# EasyEDA Pro project ProProject_f401_audio_adc_2024-01-29.epro

# Schematic Schematic1
Create Date: 2024-01-06; Page Name: P1; Project Name: f401_audio_adc; Schematic Name: Schematic1; Update Date: 2024-01-11; Company: 嘉立创EDA; Page Size: A4; Version: V1.0
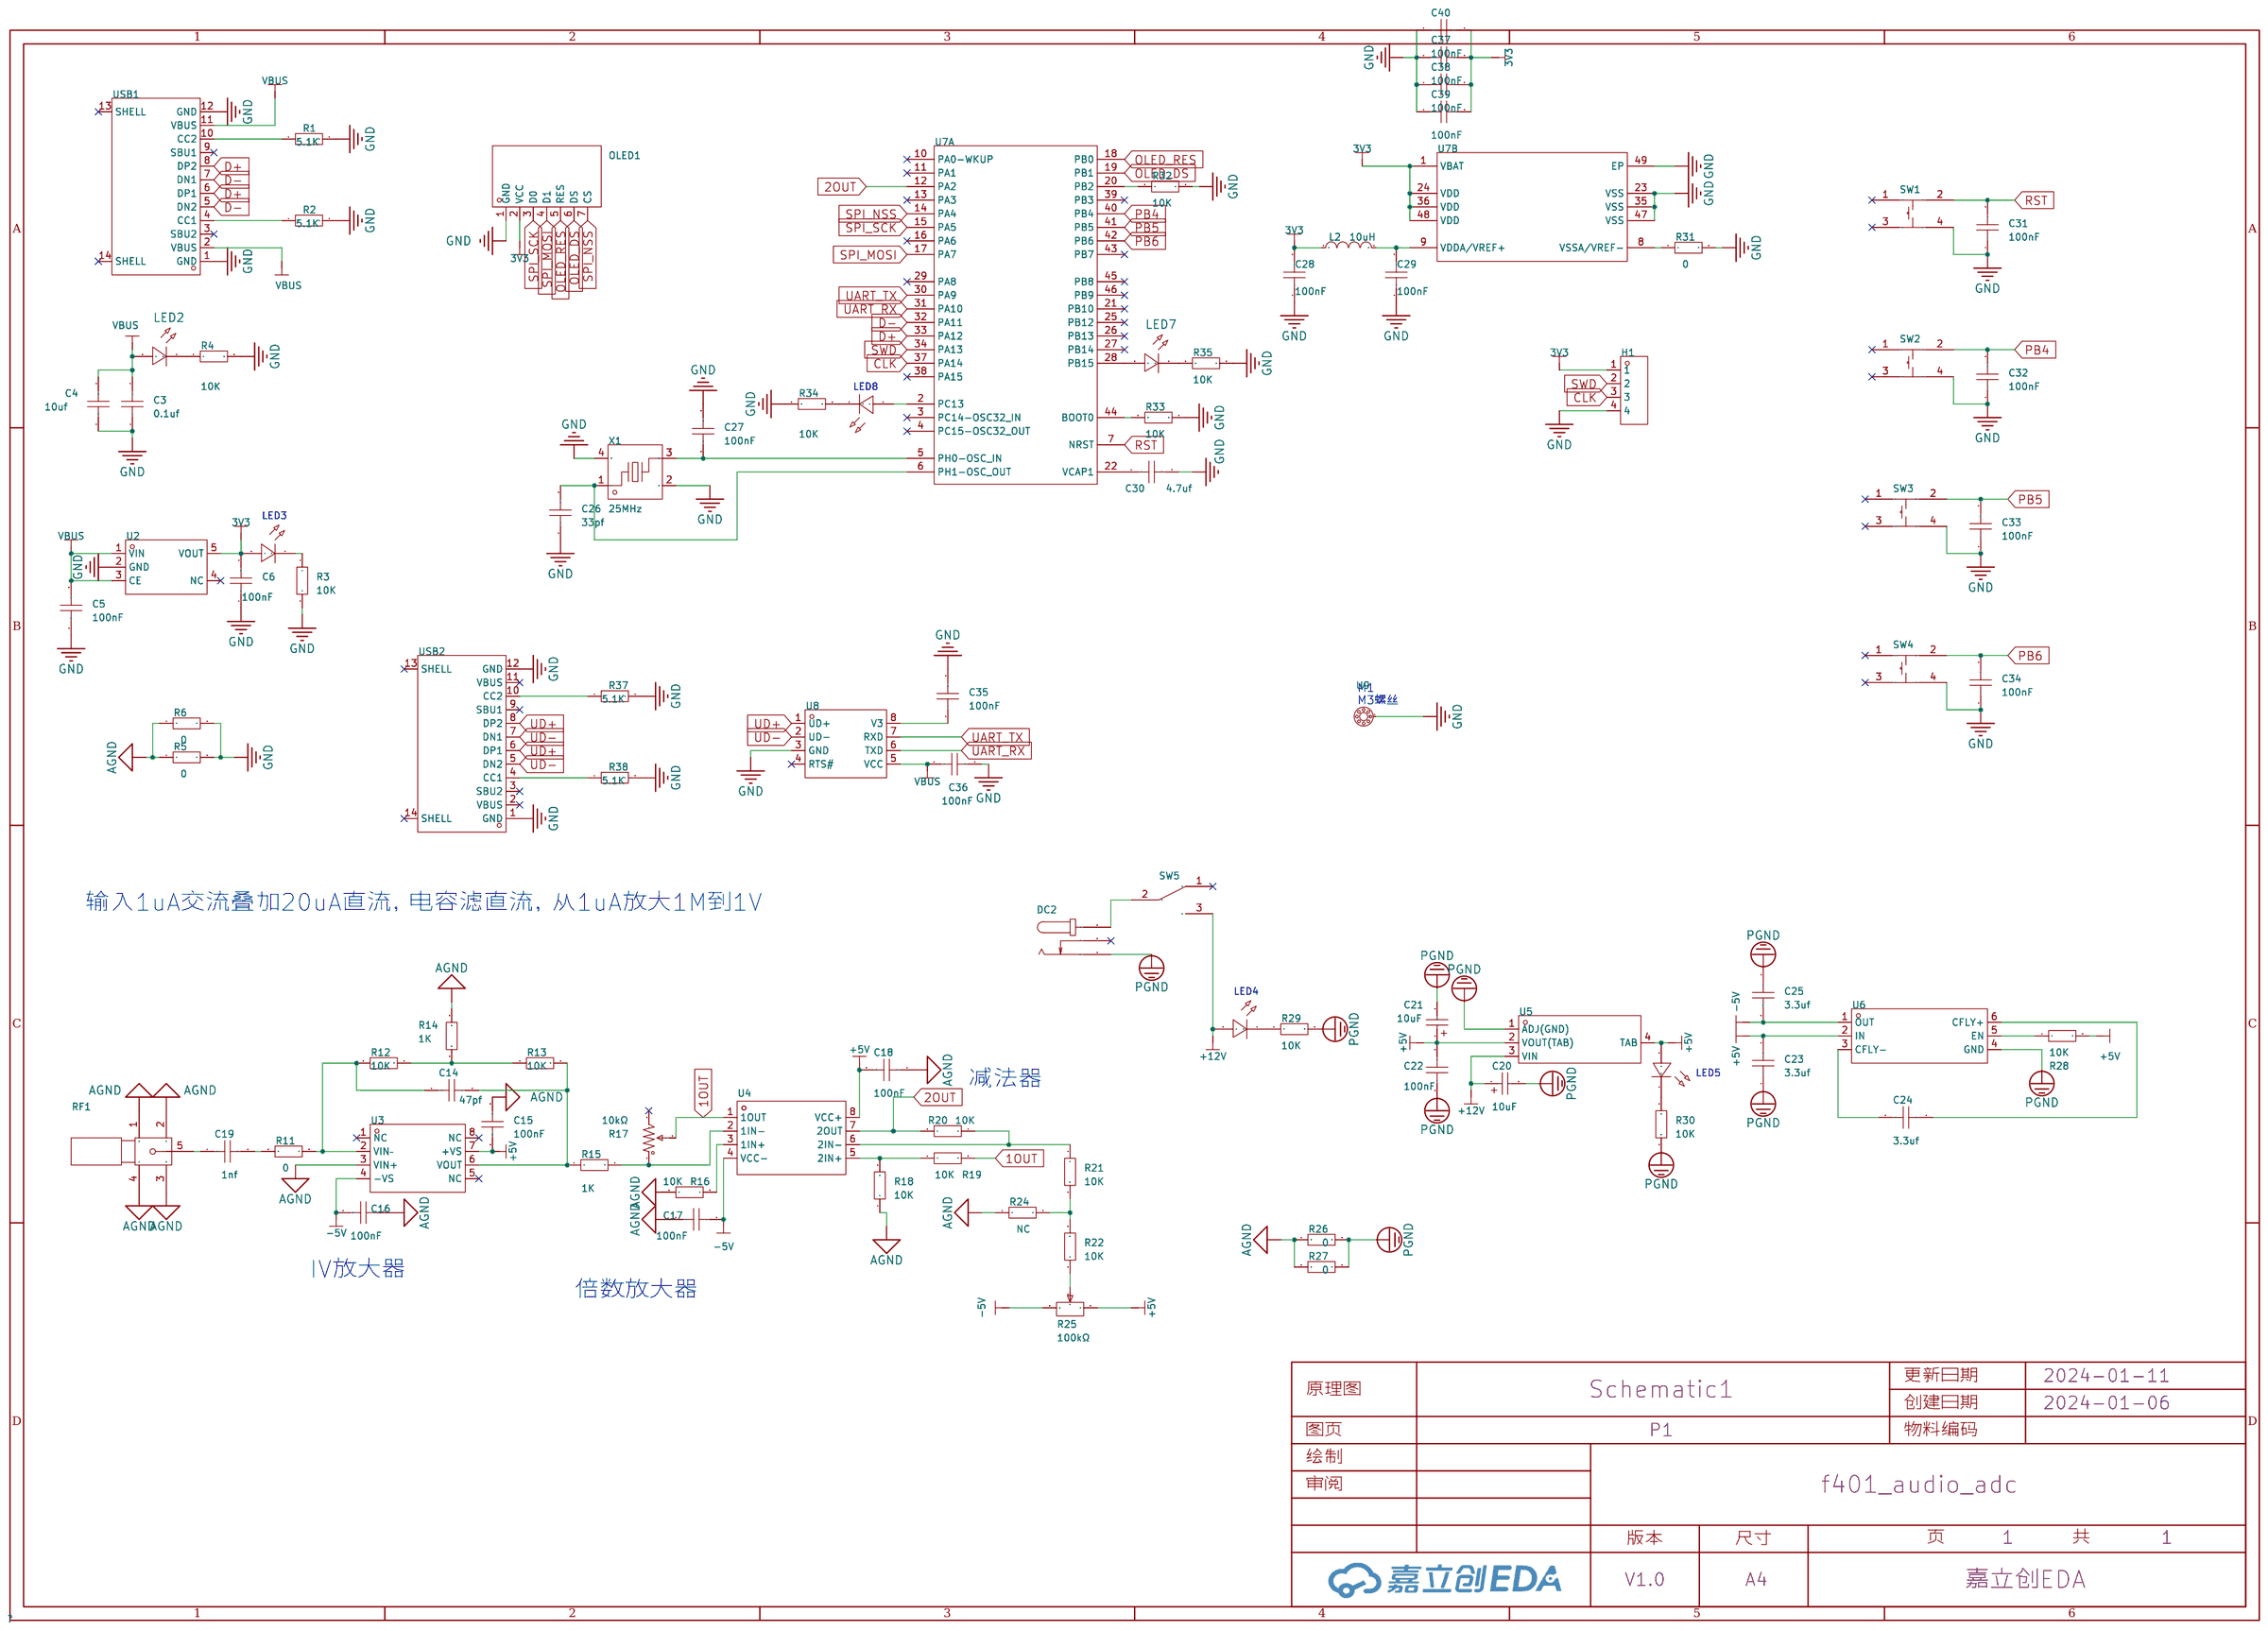
[diagram p0: schematic sheet]

## Parts
C3  0.1uf  [C0603]
C4  10uf  [C0805]
C5  100nF  [C0603]
C6  100nF  [C0603]
C14  47pf  [C0603]
C15  100nF  [C0603]
C16  100nF  [C0603]
C17  100nF  [C0603]
C18  100nF  [C0603]
C19  1nf  [C0603]
C20  10uF  [CAP-SMD_L3.2-W1.6-RD-C7171]
C21  10uF  [CAP-SMD_L3.2-W1.6-RD-C7171]
C22  100nF  [C0603]
C23  3.3uf  [C0603]
C24  3.3uf  [C0603]
C25  3.3uf  [C0603]
C26  33pf  [C0603]
C27  100nF  [C0603]
C28  100nF  [C0603]
C29  100nF  [C0603]
C30  4.7uf  [C0603]
C31  100nF  [C0603]
C32  100nF  [C0603]
C33  100nF  [C0603]
C34  100nF  [C0603]
C35  100nF  [C0603]
C36  100nF  [C0603]
C37  100nF  [C0603]
C38  100nF  [C0603]
C39  100nF  [C0603]
C40  100nF  [C0603]
DC2  DC005-T25  [DC-IN-TH_DC-005-20A-1]
H1  -  [HDR-TH_4P-P2.54-V-F]
L2  10uH  [L0805]
LED2  -  [LED_0805]
LED3  -  [LED_0805]
LED4  -  [LED_0805]
LED5  -  [LED_0805]
LED7  -  [LED_0805]
LED8  -  [LED_0805]
OLED1  HEADER7X2B  [OLED 0.96]
R1  5.1K  [R0603]
R2  5.1K  [R0603]
R3  10K  [R0603]
R4  10K  [R0603]
R5  0  [R0603]
R6  0  [R0603]
R11  0  [R0603]
R12  10K  [R0603]
R13  10K  [R0603]
R14  1K  [R0603]
R15  1K  [R0603]
R16  10K  [R0603]
R17  10kΩ  [RES-ADJ-TH_3362P]
R18  10K  [R0603]
R19  10K  [R0603]
R20  10K  [R0603]
R21  10K  [R0603]
R22  10K  [R0603]
R24  NC  [R0603]
R25  100kΩ  [RES-ADJ-TH_3296W]
R26  0  [R0603]
R27  0  [R0603]
R28  10K  [R0603]
R29  10K  [R0603]
R30  10K  [R0603]
R31  0  [R0603]
R32  10K  [R0603]
R33  10K  [R0603]
R34  10K  [R0603]
R35  10K  [R0603]
R37  5.1K  [R0603]
R38  5.1K  [R0603]
RF1  BWSMA-KWE-Z001  [SMA-TH_BWSMA-KWE-Z001]
SW1  K2-1808SN-A3SW-01  [SW-SMD_4P-L4.2-W3.3-P2.15-LS5.1]
SW2  K2-1808SN-A3SW-01  [SW-SMD_4P-L4.2-W3.3-P2.15-LS5.1]
SW3  K2-1808SN-A3SW-01  [SW-SMD_4P-L4.2-W3.3-P2.15-LS5.1]
SW4  K2-1808SN-A3SW-01  [SW-SMD_4P-L4.2-W3.3-P2.15-LS5.1]
SW5  钮子开关  [纽子开关]
U2  RT9013-33GB-MS  [SOT-23-5_L2.9-W1.6-P0.95-LS2.8-BR]
U3  OPA657U  [SOIC-8_L4.9-W3.9-P1.27-LS6.0-TL]
U4  LF353DR  [SOIC-8_L5.0-W4.0-P1.27-LS6.0-BL]
U5  AMS1117-5.0  [SOT-223_L6.7-W3.5-P2.30-BR]
U6  SGM3204YN6G/TR  [SOT-23-6_L2.9-W1.6-P0.95-LS2.8-BR]
U7  STM32F401CCU6  [UFQFPN-48_L7.0-W7.0-P0.50-BL-EP]  (sections 1,2)
U8  CH340N  [SOP-8_L4.9-W3.9-P1.27-LS6.0-BL]
U9  -  [m3]
USB1  TYPE-C 16PIN 2MD(073)  [USB-C-SMD_TYPE-C-6PIN-2MD-073]
USB2  TYPE-C 16PIN 2MD(073)  [USB-C-SMD_TYPE-C-6PIN-2MD-073]
X1  25MHz  [CRYSTAL-SMD_4P-L3.2-W2.5-BL]

## Library data of the parts
C3 C5 C6 C14-C19 C22-C40 = CAP_0603: Supplier Footprint: 0603
C4 = CAP_0805: Supplier Footprint: 0805
C20 C21 = TAJA106K016RNJ: 容值:10uF;精度:±10%;额定电压:16V;等效串联电阻:3Ω@100kHz;; LCSC Part Name: 10uF ±10% 16V; Supplier Part: C7171; Manufacturer: Kyocera AVX; Supplier Footprint: CASE-A-3216; JLCPCB Part Class: 基础库; Datasheet: https://atta.szlcsc.com/upload/public/pdf/source/20160107/1457707748093.pdf; Supplier: LCSC; Tolerance: ±10%; Rated Voltage: 16V; Equivalent Series Resistance(ESR): 3Ω@100kHz; Operating Temperature: -55℃~+125℃
DC2 = DC005-T25: 触点内径:2.5mm;触点外径:6.3mm;额定电流:-;额定电压:-;; LCSC Part Name: 内径:2.5mm 外径:6.3mm; Supplier Part: C111573; Manufacturer: SOFNG(硕方); Supplier Footprint: 插件; JLCPCB Part Class: 扩展库; Datasheet: https://atta.szlcsc.com/upload/public/pdf/source/20211217/AAF92010038535095742900872F779AE.pdf; Supplier: LCSC; Inside Contact Diameter: 2.5mm; Outside Contact Diameter: 6.3mm
H1 = HDR-F_2.54_1x4P: Supplier Part: C2718488; Supplier Footprint: 插件
L2 = L_0805
LED2 LED7 = LED_0805-R: Supplier Footprint: 0805
LED3-LED5 LED8 = LED_0805-G: Supplier Footprint: 0805
OLED1 = OLED 0.96: Supplier: LCSC; Supplier Part: C9900007473; Manufacturer: null; JLCPCB Part Class: Extended Part; _: 3
R1-R6 R11-R16 R18-R22 R24 R26-R35 R37 R38 = Res_0603: Supplier Footprint: 0603
R17 = 3362P-1-103: 阻值:10kΩ;精度:±10%;; LCSC Part Name: 10kΩ ±10%; Supplier Part: C118956; Manufacturer: BOCHEN(博晨); Supplier Footprint: 插件; JLCPCB Part Class: 扩展库; Datasheet: https://atta.szlcsc.com/upload/public/pdf/source/20171114/C118956_15106326650691117445.pdf; Supplier: LCSC; Tolerance: ±10%
R25 = 3296W-1-104LF: 阻值:100kΩ;精度:±10%;; LCSC Part Name: 100kΩ ±10%; Supplier Part: C48084; Manufacturer: BOURNS; Supplier Footprint: 插件; JLCPCB Part Class: 扩展库; Datasheet: https://atta.szlcsc.com/upload/public/pdf/source/20150811/1457707339453.pdf; Supplier: LCSC; Tolerance: ±10%
RF1 = BWSMA-KWE-Z001: 连接器类型:板端;接口类型:内孔;端口数量:1;接口直径:5.3mm;接口长度/高度:-;频率-最大值:-;射频系列:SMA;阻抗:50Ω;样式:弯头;触头材质:-;触头镀层:-;工作温度范围:-;焊接温度(最大值):-;; LCSC Part Name: 内孔 SMA 弯头; Supplier Part: C496551; Manufacturer: BAT WIRELESS(蝙蝠无线); Supplier Footprint: 插件; JLCPCB Part Class: 扩展库; Datasheet: https://atta.szlcsc.com/upload/public/pdf/source/20231017/997A8C2ADA7F8034A89BE1264F38CE52.pdf; Supplier: LCSC; Connector Type: 板端; Interface Type: 内孔; Number of Ports: 1; Interface Diameter: 5.3mm; RF Series: SMA; Impedance: 50Ω; Style: 弯头
SW1-SW4 = K2-1808SN-A3SW-01: 触点电流:50mA;额定电压(DC):12V;绝缘电阻:100MΩ;安装方式:立贴;作用力:180gf@±30gf;机械寿命:100000;工作温度:-25℃~+85℃;开关长度:4.2mm;开关宽度:3.25mm;开关高度:2.5mm;; LCSC Part Name: 3*4*2.5 贴片开关180G; Supplier Part: C2690012; Manufacturer: 韩国韩荣; Supplier Footprint: SMD; JLCPCB Part Class: 扩展库; Datasheet: https://atta.szlcsc.com/upload/public/pdf/source/20180927/C283535_7E7907F3E7B6C1691E1DC87E363D082A.pdf; Supplier: LCSC; Contact Current: 50mA; Voltage Rating (DC): 12V; Insulation Resistance: 100MΩ; Mounting Sytle: 立贴; Operating Force: 180gf@±30gf; Mechanical Life: 100000; Operating Temperature: -25℃~+85℃; Switch Length: 4.2mm; Switch Width: 3.25mm; Switch Height: 2.5mm
SW5 = 钮子开关: Supplier: 逐飞科技
U2 = RT9013-33GB-MS: 输出类型:固定;最大输入电压:5.5V;输出电压:3.3V;输出电流:500mA;电源纹波抑制比(PSRR):75dB@(1kHz);输出极性:正极;; Supplier Part: C7434207; Manufacturer: MSKSEMI(美森科); Supplier Footprint: SOT-23-5; JLCPCB Part Class: 扩展库; Datasheet: https://atta.szlcsc.com/upload/public/pdf/source/20230705/1D6536D82D93AC1E044F3DAE104751D9.pdf; Supplier: LCSC; Output Type: 固定; Maximum Input Voltage: 5.5V; Output Voltage: 3.3V; Output Current: 500mA; Power Supply Rejection Ratio (PSRR): 75dB@(1kHz); Output Polarity: 正极
U3 = OPA657U: 1.6GHz、低噪声、FET 输入运算放大器 8-SOIC -40 to 85; Supplier Part: C2878144; Manufacturer: TI(德州仪器); Supplier Footprint: SOIC-8; JLCPCB Part Class: 扩展库; Supplier: LCSC
U4 = LF353DR: 运放类型:J-FET;放大器组数:2;增益带宽积（GBP）:3MHz;压摆率（SR）:13 V/us;电源电压:±3.5V ~ 18V;各通道供电电流:3.6mA;; Supplier Part: C7918; Manufacturer: TI(德州仪器); Supplier Footprint: SOIC-8-150mil; JLCPCB Part Class: 扩展库; Datasheet: https://atta.szlcsc.com/upload/public/pdf/source/20180308/C7918_15204885487891413793.pdf; Supplier: LCSC; Amplifier Type: J-FET; Number of Circuits: 2; Gain Bandwidth Product（GBP）: 3MHz; Slew Rate（SR）: 13 V/us; Supply Voltage（Single）: ±3.5V ~ 18V; Iq per channel (Typ): 3.6mA; Operating Temperature: 0°C ~ 70°C
U5 = AMS1117-5.0_C347223: 输出类型:固定;最大输入电压:18V;输出电压:5V;输出电流:1A;电源纹波抑制比(PSRR):60dB@(120Hz);输出极性:正;; LCSC Part Name: 输入18V 输出5V 1A; Supplier Part: C347223; Manufacturer: UMW(友台半导体); Supplier Footprint: SOT-223; JLCPCB Part Class: 扩展库; Datasheet: https://atta.szlcsc.com/upload/public/pdf/source/20231109/155D79A26D9DB04352555A58D5969DC8.pdf; Supplier: LCSC; Output Type: 固定; Maximum Input Voltage: 18V; Output Voltage: 5V; Output Current: 1A; Power Supply Rejection Ratio (PSRR): 60dB@(120Hz); Dropout Voltage: 1.3V@(1A); Output Polarity: 正; Number of Outputs: 1
U6 = SGM3204YN6G/TR: 功能类型:电荷泵;输入电压:1.4V~5.5V;输出电压:-5.5V~-1.4V;输出电流(最大值):200mA;; Supplier Part: C194031; Manufacturer: SGMICRO(圣邦微); Supplier Footprint: SOT-23-6; JLCPCB Part Class: 扩展库; Datasheet: https://atta.szlcsc.com/upload/public/pdf/source/20180627/C194031_755051E53122D645C36CF727711B963E.pdf; Supplier: LCSC; Function: 电荷泵; Input Voltage: 1.4V~5.5V; Output Voltage: -5.5V~-1.4V; Output Current (Max): 200mA; Switching Frequency: 950kHz; Number of Outputs: 1
U7 = STM32F401CCU6: CPU内核:ARM Cortex-M4;CPU最大主频:84MHz;工作电压范围:1.7V~3.6V;程序存储容量:256KB;程序存储器类型:FLASH;RAM总容量:64KB;GPIO端口数量:36;; Supplier Part: C79861; Manufacturer: ST(意法半导体); Supplier Footprint: UFQFPN-48(7x7); JLCPCB Part Class: 扩展库; Datasheet: https://atta.szlcsc.com/upload/public/pdf/source/20160816/1471343009422.pdf; Supplier: LCSC; CPU Core: ARM Cortex-M4; CPU Maximum Speed: 84MHz; Operating Voltage Range: 1.7V~3.6V; Program Storage Size: 256KB; Program Memory Type: FLASH; RAM Size: 64KB; GPIO Ports Number: 36; ADC (Bit): 12bit; Universal Serial Bus: 有; Peripheral/Function: PWM；PWM; Secure Digital Input and Output: 有; Internal Oscillator: 有; Operating Temperature Range: -40℃~+85℃
U8 = CH340N: LCSC Part Name: USB转串口芯片 CH340; Supplier Part: C2977777; Manufacturer: WCH(南京沁恒); Supplier Footprint: SOP-8; JLCPCB Part Class: 扩展库; Datasheet: https://atta.szlcsc.com/upload/public/pdf/source/20230530/6E401E9554E9F5311886CC8B3F89B62E.pdf; Supplier: LCSC
U9 = M3焊盘
USB1 USB2 = TYPE-C 16PIN 2MD(073): 连接器类型:Type-C;标准:-;公母:母;端口数量:1;触点数量:16P;安装方式:卧贴;额定电流 - 电源:5A;工作温度范围:-25℃~+85℃;; LCSC Part Name: Type-C 母 卧贴 带定位柱 不锈钢外壳 2次模顶; Supplier Part: C2765186; Manufacturer: SHOU HAN(首韩); Supplier Footprint: SMD; JLCPCB Part Class: 扩展库; Datasheet: https://atta.szlcsc.com/upload/public/pdf/source/20211123/39B17C16241EAC15C5E277BDA434118E.pdf; Supplier: LCSC; Connector Type: Type-C; Gender: 母; Number of Ports: 1; Number of Contacts: 16P; Mounting Style: 卧贴; Current Rating - Power (Max): 5A; Operating Temperature Range: -25℃~+85℃
X1 = XL2EL89CSI-111YLC-25M: 频率:25MHz;负载电容:20pF;频率公差:±10ppm;; LCSC Part Name: 25MHz ±10ppm 20pF YSX321SL; Supplier Part: C5280577; Manufacturer: YXC(扬兴晶振); Supplier Footprint: SMD3225-4P; JLCPCB Part Class: 扩展库; Datasheet: https://atta.szlcsc.com/upload/public/pdf/source/20221123/8DAA01809C4E3F159850A71277C18D74.pdf; Supplier: LCSC; Crystal Type: 贴片无源晶振; Load Capacitance: 20pF; Frequency Tolerance: ±10ppm

## Nets
3V3: C6.2 C28.2 C37.2 C38.2 C39.2 C40.2 H1.1 L2.1 LED3.2(A) OLED1.2(VCC) U2.5(VOUT) U7.1(VBAT) U7.24(VDD) U7.36(VDD) U7.48(VDD)
+5V: C15.1 C18.2 C21.1 C22.2 C23.2 LED5.2(A) R25.1 R28.2 U3.7(+VS) U4.8(VCC+) U5.2(VOUT(TAB)) U5.4(TAB) U6.2(IN)
+12V: C20.1 LED4.2(A) SW5.3 U5.3(VIN)
-5V: C16.2 C17.2 C25.2 R25.3 U3.4(-VS) U4.4(VCC-) U6.1(OUT)
AGND: C15.2 C16.1 C17.1 C18.1 R5.1 R6.1 R14.2 R16.1 R18.1 R24.1 R26.1 R27.1 RF1.1 RF1.2 RF1.3 RF1.4 U3.3(VIN+)
GND: C3.1 C4.1 C5.1 C6.1 C26.1 C27.2 C28.1 C29.1 C30.2 C31.1 C32.1 C33.1 C34.1 C35.2 C36.2 C37.1 C38.1 C39.1 C40.1 H1.4 OLED1.1(GND) R1.2 R2.2 R3.2 R4.2 R5.2 R6.2 R31.2 R32.2 R33.2 R34.1 R35.1 R37.2 R38.2 SW1.4 SW2.4 SW3.4 SW4.4 U2.2(GND) U7.23(VSS) U7.35(VSS) U7.47(VSS) U7.49(EP) U8.3(GND) U9.1 USB1.1(GND) USB1.12(GND) USB2.1(GND) USB2.12(GND) X1.2(GND) X1.4(GND)
PGND: C20.2 C21.2 C22.1 C23.1 C25.1 DC2.2 R26.2 R27.2 R29.2 R30.2 U5.1(ADJ(GND)) U6.4(GND)
VBUS: C3.2 C4.2 C5.2 C36.1 LED2.2(A) U2.1(VIN) U2.3(CE) U8.5(VCC) USB1.2(VBUS) USB1.11(VBUS)
1OUT: R17.2 R19.2 U4.1(1OUT)
2OUT: R20.2 U4.7(2OUT) U7.12(PA2)
CLK: H1.3 U7.37(PA14)
D+: U7.33(PA12) USB1.6(DP1) USB1.8(DP2)
D-: U7.32(PA11) USB1.5(DN2) USB1.7(DN1)
OLED_DS: OLED1.6(DS) U7.19(PB1)
OLED_RES: OLED1.5(RES) U7.18(PB0)
PB4: C32.2 SW2.2 U7.40(PB4)
PB5: C33.2 SW3.2 U7.41(PB5)
PB6: C34.2 SW4.2 U7.42(PB6)
RST: C31.2 SW1.2 U7.7(NRST)
SPI_MOSI: OLED1.4(D1) U7.17(PA7)
SPI_NSS: OLED1.7(CS) U7.14(PA4)
SPI_SCK: OLED1.3(D0) U7.15(PA5)
SWD: H1.2 U7.34(PA13)
UART_RX: U7.31(PA10) U8.6(TXD)
UART_TX: U7.30(PA9) U8.7(RXD)
UD+: U8.1(UD+) USB2.6(DP1) USB2.8(DP2)
UD-: U8.2(UD-) USB2.5(DN2) USB2.7(DN1)
$1N8156: R1.1 USB1.10(CC2)
$1N8157: R2.1 USB1.4(CC1)
$1N8181: LED2.1(C) R4.1
$1N8217: LED3.1(C) R3.1
$1N8224: R12.2 R13.1 R14.1
$1N8225: C14.1 R11.2 R12.1 U3.2(VIN–)
$1N8226: C14.2 R13.2 R15.1 U3.6(VOUT)
$1N8235: C19.2 R11.1
$1N8236: C19.1 RF1.5
$1N8239: R18.2 R19.1 U4.5(2IN+)
$1N8242: R20.1 R21.1 U4.6(2IN-)
$1N8243: R21.2 R22.2 R24.2
$1N8244: R22.1 R25.2
$1N8248: R16.2 U4.3(1IN+)
$1N8249: R15.2 R17.1 U4.2(1IN-)
$1N8289: C24.2 U6.3(CFLY-)
$1N8292: C24.1 U6.6(CFLY+)
$1N8306: R28.1 U6.5(EN)
$1N8314: LED5.1(C) R30.1
$1N12238: C27.1 U7.5(PH0-OSC_IN) X1.3
$1N12242: C26.2 U7.6(PH1-OSC_OUT) X1.1
$1N12291: C29.2 L2.2 U7.9(VDDA/VREF+)
$1N12611: R31.1 U7.8(VSSA/VREF-)
$1N12664: R32.1 U7.20(PB2)
$1N12771: C30.1 U7.22(VCAP1)
$1N12812: R33.1 U7.44(BOOT0)
$1N13466: LED8.2(A) U7.2(PC13)
$1N13568: LED7.2(A) U7.28(PB15)
$1N13570: LED7.1(C) R35.2
$1N13643: LED8.1(C) R34.2
$1N14205: R37.1 USB2.10(CC2)
$1N14206: R38.1 USB2.4(CC1)
$1N14285: C35.1 U8.8(V3)
$1N17031: DC2.1 SW5.2
$1N17032: LED4.1(C) R29.1

Not connected (* = marked no-connect by the designer): DC2 3*; R17 3*; SW1 1* 3*; SW2 1* 3*; SW3 1* 3*; SW4 1* 3*; SW5 1*; U2 4(NC)*; U3 1(NC)* 5(NC)* 8(NC)*; U7 3(PC14-OSC32_IN)* 4(PC15-OSC32_OUT)* 10(PA0-WKUP)* 11(PA1)* 13(PA3)* 16(PA6)* 21(PB10)* 25(PB12)* 26(PB13)* 27(PB14)* 29(PA8)* 38(PA15)* 39(PB3)* 43(PB7)* 45(PB8)* 46(PB9)*; U8 4(RTS#)*; USB1 3(SBU2)* 9(SBU1)* 13(SHELL)* 14(SHELL)*; USB2 2(VBUS)* 3(SBU2)* 9(SBU1)* 11(VBUS)* 13(SHELL)* 14(SHELL)*

## Notes on the sheet
- 输入1uA交流叠加20uA直流，电容滤直流，从1uA放大1M到1V
- 减法器
- IV放大器
- 倍数放大器

# Board PCB1
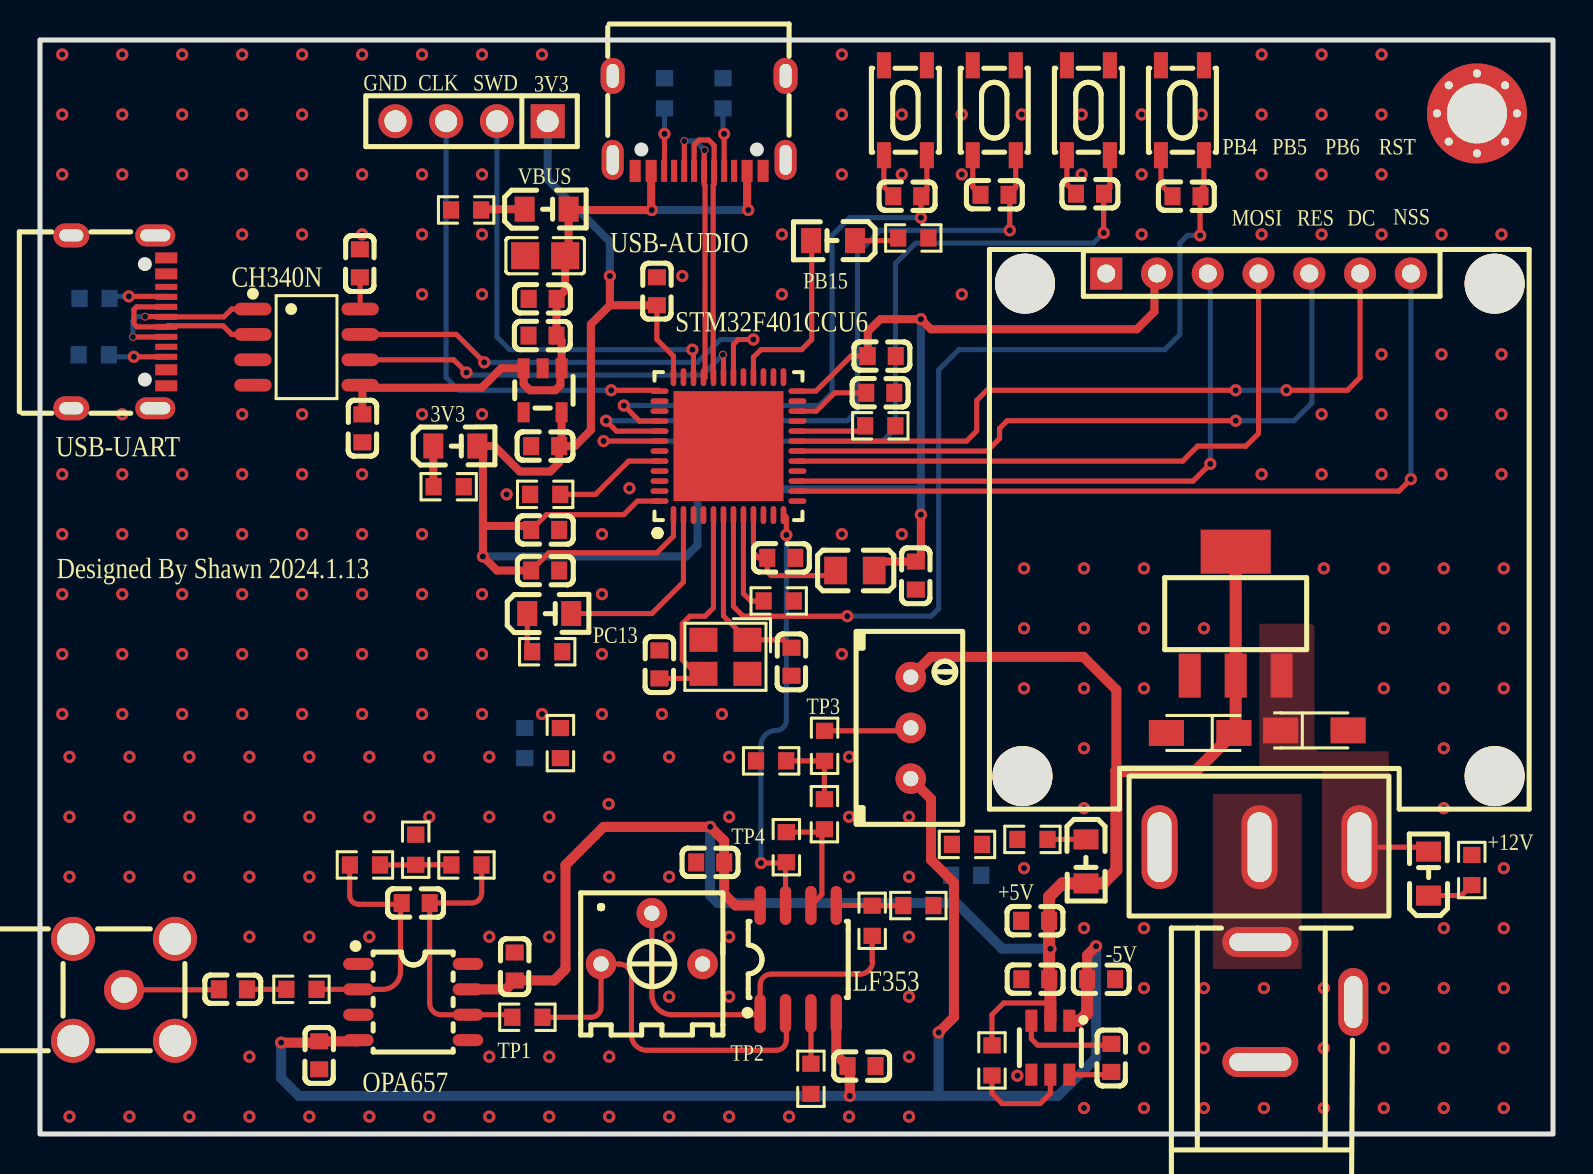
[diagram p1: board, top side]
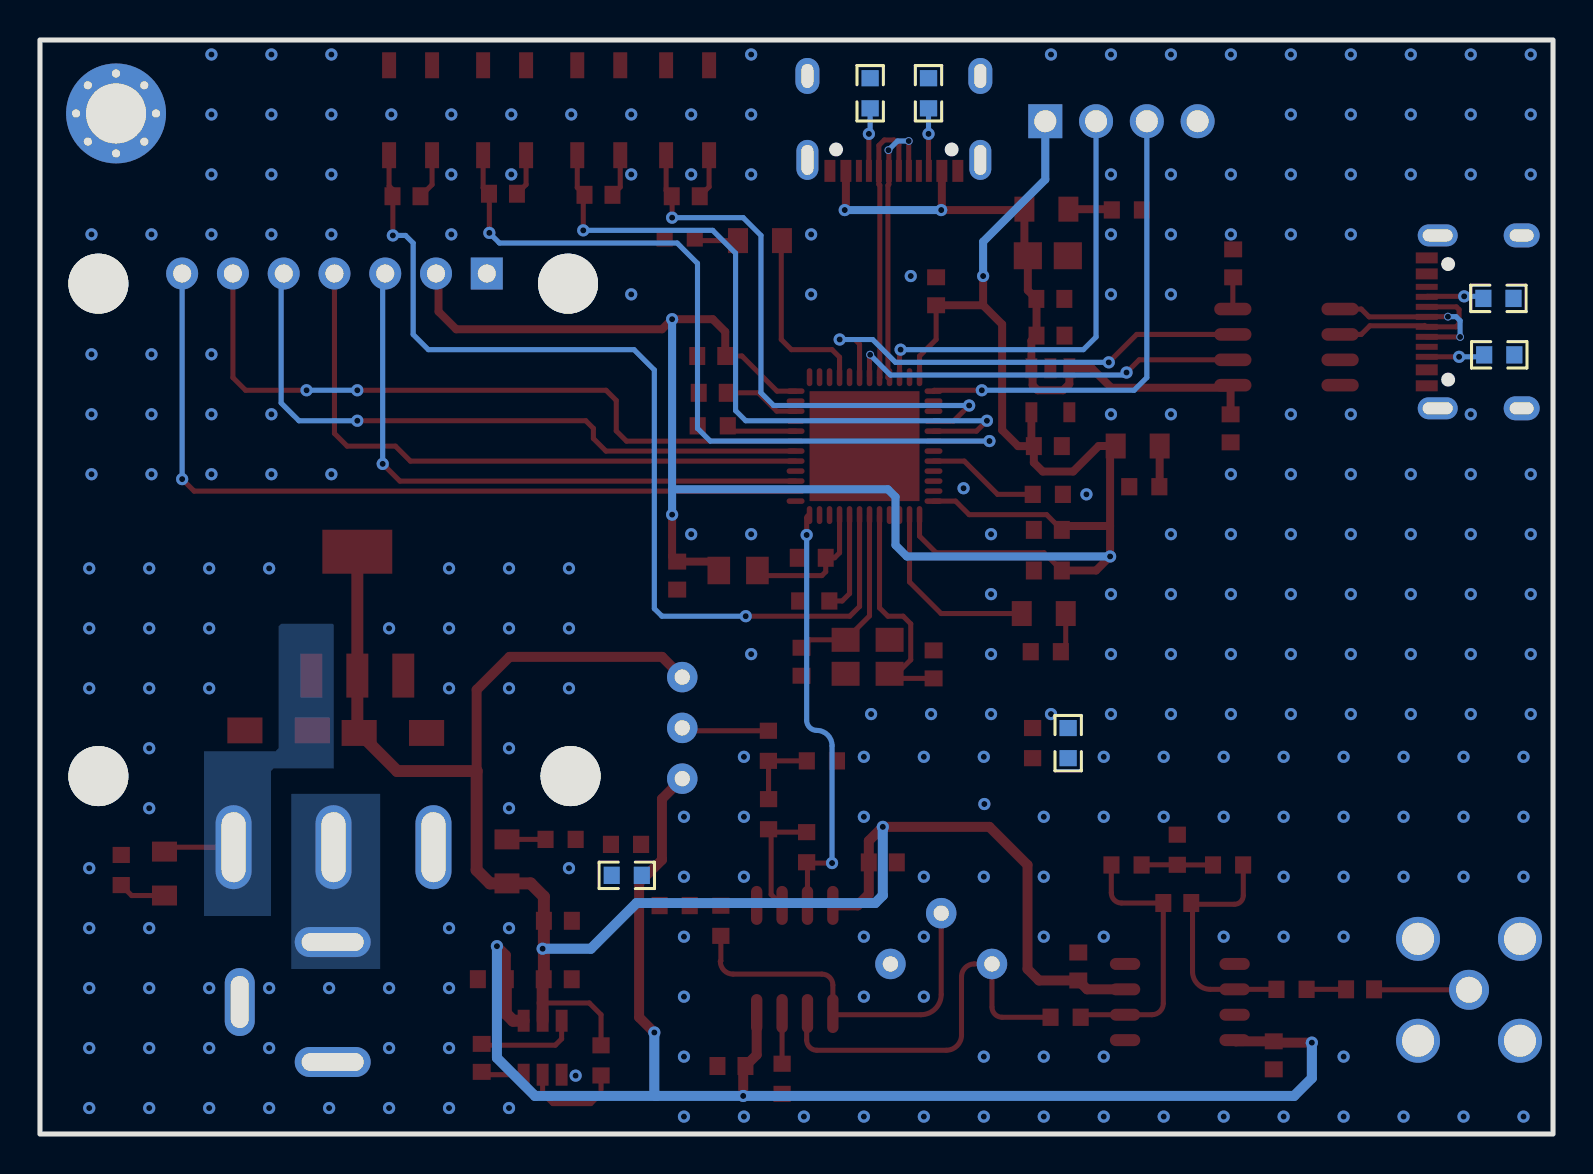
[diagram p2: board, bottom side, seen from below]

Outline 75.69 x 54.74 mm; copper layers: Top Layer, Bottom Layer. Coordinates in mm from the lower left corner of the outline.
Outline path: rectangle 0,54.74 75.69,0
Stack: Top Layer 0.035mm / Dielectric1 1.51mm FR4 er 4.5 / Bottom Layer 0.035mm

## Design rules (mm)
net D-: DP2
net D+: DP2
net UD-: DP1
net UD+: DP1
template: 自定义配置
spacing copperThickness1oz (default): track to track 0.102, other pairs 0.152 to 0.3
spacing copperThickness2oz: track to track 0.203, other pairs 0.152 to 0.3
track width copperThickness1oz (default): min 0.127, default 0.254, max 2.54
track width copperThickness2oz: min 0.203, default 0.254, max 2.54
differential pair differentialPair (default): width min 0.127, default 0.254, max 2.54; gap min 0.152, default 0.152
via viaSize (default): diameter min 0.36, default 0.61, max 10; hole min 0.3, default 0.305, max 6.3

## Placement (name value [footprint] x y rotation side)
C3  0.1uf  [C0603]  25.15 41.78 0 top
C4  10uf  [C0805]  25.27 43.94 0 top
C5  100nF  [C0603]  25.14 39.94 0 top
C6  100nF  [C0603]  25.27 34.42 0 top
C14  47pf  [C0603]  18.8 11.56 0 top
C15  100nF  [C0603]  23.75 8.38 90 top
C16  100nF  [C0603]  13.97 3.94 90 top
C17  100nF  [C0603]  41.1 3.4 180 top
C18  100nF  [C0603]  33.53 13.59 0 top
C19  1nf  [C0603]  9.65 7.24 0 top
C20  10uF  [CAP-SMD_L3.2-W1.6-RD-C7171]  63.75 20.19 0 top
C21  10uF  [CAP-SMD_L3.2-W1.6-RD-C7171]  58.04 20.07 180 top
C22  100nF  [C0603]  49.78 10.67 0 top
C23  3.3uf  [C0603]  49.79 7.74 0 top
C24  3.3uf  [C0603]  53.59 3.81 90 top
C25  3.3uf  [C0603]  53.09 7.75 180 top
C26  33pf  [C0603]  37.59 23.63 90 top
C27  100nF  [C0603]  30.99 23.5 90 top
C28  100nF  [C0603]  43.81 27.94 90 top
C29  100nF  [C0603]  37.08 28.83 180 top
C30  4.7uf  [C0603]  42.04 37.08 0 top
C31  100nF  [C0603]  57.36 46.92 0 top
C32  100nF  [C0603]  43.39 46.92 0 top
C33  100nF  [C0603]  47.75 46.99 0 top
C34  100nF  [C0603]  52.53 47.05 0 top
C35  100nF  [C0603]  16 43.56 90 top
C36  100nF  [C0603]  16.13 35.31 270 top
C37  100nF  [C0603]  25.27 28.19 180 top
C38  100nF  [C0603]  30.86 42.16 270 top
C39  100nF  [C0603]  42.11 38.92 180 top
C40  100nF  [C0603]  25.27 30.23 180 top
DC2  DC005-T25  [DC-IN-TH_DC-005-20A-1]  63.37 6.6 90 top
H1  -  [HDR-TH_4P-P2.54-V-F]  21.59 50.67 180 top
L2  10uH  [L0805]  40.77 28.19 180 top
LED2  -  [LED_0805]  25.39 46.27 0 top
LED3  -  [LED_0805]  20.83 34.42 0 top
LED4  -  [LED_0805]  69.47 13.08 90 top
LED5  -  [LED_0805]  52.32 13.59 270 top
LED7  -  [LED_0805]  39.62 44.7 180 top
LED8  -  [LED_0805]  25.53 26.03 0 top
OLED1  HEADER7X2B  [OLED 0.96]  47.5 16.26 0 top
R1  5.1K  [R0603]  31.24 52.07 90 bottom
R2  5.1K  [R0603]  34.16 52.07 90 bottom
R3  10K  [R0603]  20.45 32.39 0 top
R4  10K  [R0603]  21.32 46.23 180 top
R5  0  [R0603]  26.03 19.56 90 top
R6  0  [R0603]  24.26 19.56 90 bottom
R11  0  [R0603]  13.08 7.24 0 top
R12  10K  [R0603]  16.26 13.46 0 top
R13  10K  [R0603]  21.34 13.46 0 top
R14  1K  [R0603]  18.8 14.22 90 top
R15  1K  [R0603]  24.38 5.84 0 top
R16  10K  [R0603]  38.57 2.76 90 top
R17  10kΩ  [RES-ADJ-TH_3362P]  30.61 9.78 0 top
R18  10K  [R0603]  43.94 11.43 180 top
R19  10K  [R0603]  41.63 10.67 270 top
R20  10K  [R0603]  37.34 14.35 270 top
R21  10K  [R0603]  39.24 16 90 top
R22  10K  [R0603]  39.25 19.42 270 top
R24  NC  [R0603]  36.58 18.67 0 top
R25  100kΩ  [RES-ADJ-TH_3296W]  43.56 20.32 0 top
R26  0  [R0603]  46.34 12.94 0 bottom
R27  0  [R0603]  46.37 14.49 0 top
R28  10K  [R0603]  47.62 3.68 90 top
R29  10K  [R0603]  71.63 13.21 90 top
R30  10K  [R0603]  49.65 14.74 180 top
R31  0  [R0603]  36.96 26.67 0 top
R32  10K  [R0603]  42.04 35.43 0 top
R33  10K  [R0603]  25.27 32 180 top
R34  10K  [R0603]  25.37 24.13 180 top
R35  10K  [R0603]  43.69 44.83 180 top
R37  5.1K  [R0603]  2.69 38.98 180 bottom
R38  5.1K  [R0603]  2.73 41.81 180 bottom
RF1  BWSMA-KWE-Z001  [SMA-TH_BWSMA-KWE-Z001]  4.2 7.21 180 top
SW1  K2-1808SN-A3SW-01  [SW-SMD_4P-L4.2-W3.3-P2.15-LS5.1]  57.15 51.22 270 top
SW2  K2-1808SN-A3SW-01  [SW-SMD_4P-L4.2-W3.3-P2.15-LS5.1]  43.29 51.22 270 top
SW3  K2-1808SN-A3SW-01  [SW-SMD_4P-L4.2-W3.3-P2.15-LS5.1]  47.74 51.22 270 top
SW4  K2-1808SN-A3SW-01  [SW-SMD_4P-L4.2-W3.3-P2.15-LS5.1]  52.45 51.22 270 top
SW5  钮子开关  [纽子开关]  54.48 17.91 0 top
U2  RT9013-33GB-MS  [SOT-23-5_L2.9-W1.6-P0.95-LS2.8-BR]  25.15 37.21 90 top
U3  OPA657U  [SOIC-8_L4.9-W3.9-P1.27-LS6.0-TL]  18.67 6.6 0 top
U4  LF353DR  [SOIC-8_L5.0-W4.0-P1.27-LS6.0-BL]  37.93 8.73 0 top
U5  AMS1117-5.0  [SOT-223_L6.7-W3.5-P2.30-BR]  59.82 26.03 270 top
U6  SGM3204YN6G/TR  [SOT-23-6_L2.9-W1.6-P0.95-LS2.8-BR]  50.55 4.32 90 top
U7  STM32F401CCU6  [UFQFPN-48_L7.0-W7.0-P0.50-BL-EP]  34.44 34.42 0 top
U8  CH340N  [SOP-8_L4.9-W3.9-P1.27-LS6.0-BL]  13.33 39.37 270 top
U9  -  [m3]  71.89 51.06 0 top
USB1  TYPE-C 16PIN 2MD(073)  [USB-C-SMD_TYPE-C-6PIN-2MD-073]  32.98 50.56 180 top
USB2  TYPE-C 16PIN 2MD(073)  [USB-C-SMD_TYPE-C-6PIN-2MD-073]  3.94 40.63 270 top
X1  25MHz  [CRYSTAL-SMD_4P-L3.2-W2.5-BL]  34.29 23.88 180 top

## Footprints (pads in the part's own frame, mm; a bottom-side part is the same pattern mirrored in y, then rotated)
C0603
  rect 0.8x0.9 smd: 1(-0.7,0) 2(0.7,0)
C0805
  rect 1.41x1.35 smd: 1(-1,0) 2(1,0)
CAP-SMD_L3.2-W1.6-RD-C7171
  rect 1.758x1.296 smd: 1(-1.687,0) 2(1.687,0)
CRYSTAL-SMD_4P-L3.2-W2.5-BL
  rect 1.4x1.2 smd: 1(-1.1,-0.85) 2(1.1,-0.85) 3(1.1,0.85) 4(-1.1,0.85)
DC-IN-TH_DC-005-20A-1
  oval 1.5x3.8 hole 0.9x3.1: 1(3,2.325) 2(-3,2.325)
  oval 3.4x1.5 hole 2.6x0.9: 3(0,-2.325)
HDR-TH_4P-P2.54-V-F
  rect 1.7x1.7 hole 1.1: 1(-3.81,0)
  round 1.7 hole 1.1: 2(-1.27,0) 3(1.27,0) 4(3.81,0)
L0805
  rect 1.133x1.377 smd: 1(-0.966,0) 2(0.966,0)
LED_0805
  rect 1x1.25 smd: 1(-1.15,0.005) 2(1.05,0.005)
m3
  round 0.6 hole 0.405x0.4: 1(-2,0) 1(-1.41,1.41) 1(-1.41,-1.41) 1(0,2) 1(0,-2) 1(1.41,1.41) 1(1.41,-1.41) 1(2,0)
  round 5 hole 3.005x3: 1(0,0)
OLED 0.96
  round 3 hole 3: 8(25.273,26.289) 9(25.273,1.651) 10(1.651,1.651) !(1.778,26.289)
  rect 1.6x1.6 hole 0.9: 1(5.842,26.797)
  round 1.6 hole 0.9: 2(8.382,26.797) 3(10.922,26.797) 4(13.462,26.797) 5(16.002,26.797) 6(18.542,26.797) 7(21.082,26.797)
R0603
  rect 0.806x0.864 smd: 1(-0.753,0) 2(0.753,0)
RES-ADJ-TH_3296W
  round 1.524 hole 0.762: 1(0,2.54) 2(0,0) 3(0,-2.54)
RES-ADJ-TH_3362P
  round 1.524 hole 0.762: 1(-2.54,-1.27) 2(0,1.27) 3(2.54,-1.27)
SMA-TH_BWSMA-KWE-Z001
  round 2.2 hole 1.6: 1(-2.55,-2.55) 2(-2.55,2.55) 3(2.55,2.55) 4(2.55,-2.55)
  round 2 hole 1.3: 5(0,0)
SOIC-8_L4.9-W3.9-P1.27-LS6.0-TL
  oval 1.52x0.6 smd: 1(-2.74,1.905) 2(-2.74,0.635) 3(-2.74,-0.635) 4(-2.74,-1.905) 5(2.74,-1.905) 6(2.74,-0.635) 7(2.74,0.635) 8(2.74,1.905)
SOIC-8_L5.0-W4.0-P1.27-LS6.0-BL
  oval 0.569x1.95 smd: 1(-1.905,-2.705) 2(-0.635,-2.705) 3(0.635,-2.705) 4(1.905,-2.705) 5(1.905,2.705) 6(0.635,2.705) 7(-0.635,2.705) 8(-1.905,2.705)
SOP-8_L4.9-W3.9-P1.27-LS6.0-BL
  oval 0.63x1.865 smd: 1(-1.905,-2.683) 2(-0.635,-2.683) 3(0.635,-2.683) 4(1.905,-2.683) 5(1.905,2.683) 6(0.635,2.683) 7(-0.635,2.683) 8(-1.905,2.683)
SOT-23-5_L2.9-W1.6-P0.95-LS2.8-BR
  rect 1x0.6 smd: 1(1.1,-0.95) 2(1.1,0) 3(1.1,0.95) 4(-1.1,0.95) 5(-1.1,-0.95)
SOT-23-6_L2.9-W1.6-P0.95-LS2.8-BR
  rect 1.1x0.6 smd: 1(1.35,-0.95) 2(1.35,0) 3(1.35,0.95) 4(-1.35,0.95) 5(-1.35,0) 6(-1.35,-0.95)
SOT-223_L6.7-W3.5-P2.30-BR
  rect 2.2x1.1 smd: 1(3.099,-2.3) 2(3.099,0) 3(3.099,2.3)
  rect 2.2x3.5 smd: 4(-3.099,0)
SW-SMD_4P-L4.2-W3.3-P2.15-LS5.1
  rect 1.3x0.7 smd: 1(-2.25,1.075) 2(2.25,1.075) 3(-2.25,-1.075) 4(2.25,-1.075)
UFQFPN-48_L7.0-W7.0-P0.50-BL-EP
  oval 0.28x0.9 smd: 1(-2.751,-3.45) 2(-2.251,-3.45) 3(-1.75,-3.45) 4(-1.25,-3.45) 5(-0.749,-3.45) 6(-0.249,-3.45) 7(0.249,-3.45) 8(0.75,-3.45) 9(1.25,-3.45) 10(1.75,-3.45) 11(2.251,-3.45) 12(2.751,-3.45) 25(2.751,3.449) 26(2.251,3.449) 27(1.75,3.449) 28(1.25,3.449) 29(0.75,3.449) 30(0.249,3.449) 31(-0.249,3.449) 32(-0.749,3.449) 33(-1.25,3.449) 34(-1.75,3.449) 35(-2.251,3.449) 36(-2.751,3.449)
  oval 0.9x0.28 smd: 13(3.45,-2.751) 14(3.45,-2.251) 15(3.45,-1.75) 16(3.45,-1.25) 17(3.45,-0.75) 18(3.45,-0.249) 19(3.45,0.249) 20(3.45,0.749) 21(3.45,1.25) 22(3.45,1.75) 23(3.45,2.251) 24(3.45,2.751) 37(-3.449,2.751) 38(-3.449,2.251) 39(-3.449,1.75) 40(-3.449,1.25) 41(-3.449,0.749) 42(-3.449,0.249) 43(-3.449,-0.249) 44(-3.449,-0.75) 45(-3.449,-1.25) 46(-3.449,-1.75) 47(-3.449,-2.251) 48(-3.449,-2.751)
  rect 5.5x5.5 smd: 49(0,0)
USB-C-SMD_TYPE-C-6PIN-2MD-073
  rect 0.55x1.1 smd: 1(-3.2,2.375) 2(-2.4,2.375) 11(2.4,2.375) 12(3.2,2.375)
  rect 0.3x1.1 smd: 3(-1.75,2.375) 4(-1.25,2.375) 5(-0.75,2.375) 6(-0.25,2.375) 7(0.25,2.375) 8(0.75,2.375) 9(1.25,2.375) 10(1.75,2.375)
  oval 1.1x2 hole 0.6x1.5: 13(-4.325,1.825) 14(4.325,1.825)
  oval 1.2x1.8 hole 0.6x1.2: 13(-4.325,-2.375) 14(4.325,-2.375)
纽子开关
  oval 1.8x4.2 hole 1.2x3.5: 1(1.524,-3.556) 2(6.524,-3.556) 3(11.524,-3.556)

## Nets
As in the schematic.

Pads without a net: DC2 3; OLED1 8 9 10 !; R17 3; SW1 1 3; SW2 1 3; SW3 1 3; SW4 1 3; SW5 1; U2 4; U3 1 5 8; U7 3 4 10 11 13 16 21 25 26 27 29 38 39 43 45 46; U8 4; USB1 3 9 13 14; USB2 2 3 9 11 13 14

## Via types
v1: diameter 0.61, hole 0.304, Top Layer to Bottom Layer, 242 vias
v2: diameter 0.61, hole 0.305, Top Layer to Bottom Layer, 39 vias
v3: diameter 0.39, hole 0.3, Top Layer to Bottom Layer, 4 vias
v4: diameter 0.4, hole 0.3, Top Layer to Bottom Layer, 1 via

## Routing (per net, layer and track width the routed paths; a pad name or vN(x,y) marks a point on that pad's centre or on a via; arc(x,y) is an arc through that point)
3V3: length 121.2
  Top Layer w0.254: C40.2 25.33,30.99 29.21,30.99 29.89,31.67 U7.48 ; U7.24 38.82,37.17 40.58,38.92 C39.2 ; U7.36 31.69,38.92 30.86,39.75 C38.2 ; C37.2 25.46,29.08 30.86,29.08 31.69,29.91 U7.1
  Top Layer w0.4: 22.16,34.42 LED3.2 ; 22.16,34.42 22.73,34.42 24,33.15 25.53,33.15 25.97,33.59 C6.2 ; 22.16,34.42 22.16,30.42 ; 28.51,41.46 v2(28.51,42.93) ; 28.51,41.46 27.56,40.51 27.56,35.22 26.76,34.42 C6.2 ; 28.51,41.46 C38.2 ; C37.2 22.86,28.19 v2(22.16,28.9) 22.16,30.42 ; C40.2 24.38,30.42 22.16,30.42 ; C6.2 26.1,34.54 U2.5 ; L2.1 42.18,28.64 C28.2 44.07,28.89 v2(44.07,30.99) ; C39.2 41.41,40.14 42.04,40.77 v2(44.07,40.77) 44.57,40.26 54.87,40.26 55.75,41.15 55.75,42.93 OLED1.2
  Bottom Layer w0.4: H1.1 25.4,47.75 28.51,44.64 v2(28.51,42.93) ; 44.07,32.26 33.27,32.26 32.89,31.88 32.89,29.46 32.33,28.9 v2(22.16,28.9) ; 44.07,32.26 v2(44.07,40.77) ; 44.07,32.26 v2(44.07,30.99)
+5V: length 96.9
  Top Layer w0.254: R28.2 47.62,5.97 48.21,6.56 50.55,6.56
  Top Layer w0.5: 53.85,18.16 53.85,22.22 52.2,23.87 44.57,23.87 R25.1 ; U4.8 34.79,11.44 34.23,12 C18.2 34.23,14.67 v2(33.53,15.37) 28.19,15.37 26.29,13.46 26.29,8.25 25.72,7.68 C15.1 23.31,7.24 U3.7 ; v2(50.55,9.27) 50.48,9.21
  Top Layer w0.6: U5.4 U5.2 59.82,20.16 C21.1 57.82,18.16 53.85,18.16 53.85,13.21 53.18,12.54 LED5.2 51.15,12.54 50.48,11.88 C22.2 50.48,7.75 C23.2 50.55,7.69 U6.2
  Bottom Layer w0.5: v2(50.55,9.27) 48.13,9.27 45.85,11.56 33.91,11.56 33.53,11.94 v2(33.53,15.37)
+12V: length 3.5
  Top Layer w0.254: SW5.3 69.24,14.35 69.46,14.13
-5V: length 79.3
  Top Layer w0.5: R25.3 44.58,16.76 44.58,13.72 45.72,12.57 45.72,5.84 v2(44.96,5.08) ; v2(52.83,9.4) 52.39,8.95 C25.2 ; U3.4 15.87,4.64 13.97,4.64 13.91,4.57 v2(12.06,4.57) ; U4.4 39.84,3.96 C17.2 40.51,3.29 v2(40.51,1.91)
  Top Layer w0.6: U6.1 52.02,5.67 52.39,6.03 C25.2
  Bottom Layer w0.5: 44.88,1.91 44.96,1.98 v2(44.96,5.08) ; 44.88,1.91 50.93,1.91 52.83,3.81 v2(52.83,9.4) ; 44.88,1.91 v2(40.51,1.91) 12.95,1.91 12.06,2.79 v2(12.06,4.57)
AGND:
  vias: v1(1.48,18.87) v1(1.48,15.87) v1(1.48,12.87) v1(1.48,0.87) v1(4.48,18.87) v1(4.48,15.87) v1(4.48,12.87) v1(4.48,0.87) v1(7.48,18.87) v1(7.48,15.87) v1(7.48,12.87) v1(7.48,0.87) v1(10.48,18.87) v1(10.48,15.87) v1(10.48,12.87) v1(10.48,9.87) v1(10.48,3.87) v1(10.48,0.87) v1(13.48,18.87) v1(13.48,15.87) v1(13.48,12.87) v1(13.48,9.87) v1(13.48,0.87) v1(16.48,18.87) v1(16.48,15.87) v1(16.48,9.87) v1(16.48,0.87) v1(19.48,18.87) v1(19.48,15.87) v1(19.48,0.87) v1(22.48,18.87) v1(22.48,15.87) v1(22.48,9.87) v1(22.48,3.87) v1(22.48,0.87) v1(25.48,15.87) v1(25.48,12.87) v1(25.48,9.87) v1(25.48,3.87) v1(25.48,0.87) v1(28.48,18.87) v1(28.45,16.51) v1(28.48,12.87) v1(28.48,3.87) v1(28.48,0.87) v1(31.48,18.87) v1(31.48,12.87) v1(31.48,9.87) v1(31.48,6.87) v1(31.48,0.87) v1(34.48,18.87) v1(34.48,15.87) v1(34.48,9.87) v1(34.48,6.87) v1(34.48,0.87) v1(37.48,0.87) v1(40.48,18.87) v1(40.48,15.87) v1(40.48,12.87) v1(40.48,0.87) v1(43.48,15.87) v1(43.48,12.87) v1(43.48,9.87) v1(43.48,6.87) v1(43.48,3.87) v1(43.48,0.87)
GND: length 8.8
  Top Layer w0.254: C33.1 46.66,47.38 SW3.4 ; SW1.4 56.08,47.5 C31.1 ; C32.1 42.22,47.39 SW2.4 ; C34.1 51.37,47.5 SW4.4
  vias: v1(1.11,54.01) v1(1.11,51.01) v1(1.11,48.01) v1(1.11,33.01) v1(1.11,30.01) v1(1.11,27.01) v1(1.11,24.01) v1(1.11,21.01) v1(4.11,54.01) v1(4.11,51.01) v1(4.11,48.01) v1(4.11,36.01) v1(4.11,33.01) v1(4.11,30.01) v1(4.11,27.01) v1(4.11,24.01) v1(4.11,21.01) v1(7.11,54.01) v1(7.11,51.01) v1(7.11,48.01) v1(7.11,33.01) v1(7.11,30.01) v1(7.11,27.01) v1(7.11,24.01) v1(7.11,21.01) v1(10.11,54.01) v1(10.11,51.01) v1(10.11,48.01) v1(10.11,45.01) v1(10.11,36.01) v1(10.11,33.01) v1(10.11,30.01) v1(10.11,27.01) v1(10.11,24.01) v1(10.11,21.01) v1(13.11,54.01) v1(13.11,51.01) v1(13.11,48.01) v1(13.11,45.01) v1(13.11,36.01) v1(13.11,33.01) v1(13.11,30.01) v1(13.11,27.01) v1(13.11,24.01) v1(13.11,21.01) v1(16.11,54.01) v1(16.11,48.01) v1(16.11,45.01) v1(16.11,33.01) v1(16.11,30.01) v1(16.11,27.01) v1(16.11,24.01) v1(16.11,21.01) v1(19.11,54.01) v1(19.11,48.01) v1(19.11,45.01) v1(19.11,42.01) v1(19.11,36.01) v1(19.11,30.01) v1(19.11,27.01) v1(19.11,24.01) v1(19.11,21.01) v1(22.11,54.01) v1(22.11,48.01) v1(22.11,45.01) v1(22.11,42.01) v1(22.11,36.01) v1(22.11,27.01) v1(22.11,24.01) v1(22.11,21.01) v1(25.11,54.01) v1(25.11,21.01) v1(28.11,30.01) v1(28.11,27.01) v1(28.11,24.01) v1(28.11,21.01) v1(31.11,21.01) v1(32.13,42.93) v1(34.11,21.01) v1(37.11,45.01) v1(37.11,42.01) v1(40.11,54.01) v1(40.11,51.01) v1(40.11,48.01) v1(40.11,30.01) v1(40.11,24.01) v1(43.11,51.01) v1(43.11,48.01) v1(43.11,30.01) v1(46.11,51.01) v1(46.11,48.01) v1(46.11,42.01) v1(49.11,51.01) v1(52.11,51.01) v1(52.11,48.01) v1(55.11,51.01) v1(55.11,48.01) v1(55.11,45.01) v1(58.11,51.01) v1(61.11,54.01) v1(61.11,51.01) v1(61.11,48.01) v1(61.11,45.01) v1(61.11,33.01) v1(64.11,54.01) v1(64.11,51.01) v1(64.11,48.01) v1(64.11,45.01) v1(64.11,36.01) v1(64.11,33.01) v1(67.11,54.01) v1(67.11,51.01) v1(67.11,48.01) v1(67.11,45.01) v1(67.11,39.01) v1(67.11,36.01) v1(67.11,33.01) v1(70.11,45.01) v1(70.11,39.01) v1(70.11,36.01) v1(70.11,33.01) v1(73.11,45.01) v1(73.11,39.01) v1(73.11,36.01) v1(73.11,33.01) v2(23.34,32) v2(29.49,32.31)
PGND:
  vias: v1(49.23,28.3) v1(49.23,25.3) v1(49.23,22.3) v1(49.23,13.3) v1(52.23,28.3) v1(52.23,25.3) v1(52.23,22.3) v1(52.23,19.3) v1(52.23,16.3) v1(52.23,10.3) v1(52.23,1.3) v1(55.23,28.3) v1(55.23,25.3) v1(55.23,22.3) v1(55.23,10.3) v1(55.23,7.3) v1(55.23,4.3) v1(55.23,1.3) v1(58.23,25.3) v1(58.23,7.3) v1(58.23,4.3) v1(58.23,1.3) v1(61.23,7.3) v1(61.23,1.3) v1(64.23,28.3) v1(64.23,7.3) v1(64.23,4.3) v1(64.23,1.3) v1(67.23,28.3) v1(67.23,25.3) v1(67.23,22.3) v1(67.23,7.3) v1(67.23,4.3) v1(67.23,1.3) v1(70.23,28.3) v1(70.23,25.3) v1(70.23,22.3) v1(70.23,19.3) v1(70.23,16.3) v1(70.23,10.3) v1(70.23,7.3) v1(70.23,4.3) v1(70.23,1.3) v1(73.23,28.3) v1(73.23,25.3) v1(73.23,22.3) v1(73.23,13.3) v1(73.23,10.3) v1(73.23,7.3) v1(73.23,4.3) v1(73.23,1.3) v2(48.89,2.92)
VBUS: length 35
  Top Layer w0.4: 16.13,37.35 16.14,37.34 22.1,37.34 23.07,38.31 24.2,38.31 24.2,37.53 24.51,37.21 25.78,37.21 26.03,37.47 26.03,38.25 U2.1 26.1,39.69 C5.2 25.84,41.78 C3.2 26.27,42.21 C4.2 26.44,44.11 LED2.2 26.49,46.23 v2(30.61,46.23) 30.58,46.26 USB1.11 ; 16.13,37.35 C36.1 ; 16.13,37.35 U8.5 ; USB1.2 35.37,46.29 v2(35.43,46.23)
  Bottom Layer w0.4: v2(35.43,46.23) v2(30.61,46.23)
1OUT: length 19.1
  Top Layer w0.254: R19.2 41.63,8.66 41.66,8.64 arc(41.47,8.19) 41.02,8 36.58,8 arc(36.19,7.84) 36.03,7.45 U4.1 arc(36.01,5.99) 35.97,5.97 31.62,5.97 arc(30.9,6.27) 30.61,6.98 R17.2
2OUT: length 21.6
  Top Layer w0.254: 37.3,13.56 v2(36.07,13.56) ; 37.3,13.56 U4.7 ; 37.3,13.56 arc(37.31,13.59) R20.2 ; v2(37.34,29.97) 37.34,30.82 arc(37.3,30.93) U7.12
  Bottom Layer w0.254: v2(36.07,13.56) 36.07,19.43 arc(36.29,19.97) 36.83,20.19 arc(37.19,20.34) 37.34,20.7 v2(37.34,29.97)
CLK: length 23.8
  Top Layer w0.254: U7.37 30.95,37.21 v2(28.58,37.21)
  Bottom Layer w0.254: 20.32,50.67 20.32,37.85 20.95,37.21 v2(28.58,37.21)
D+: length 14.2
  Top Layer w0.254: v3(32.23,49.68) 32.23,48.19 USB1.8 ; v3(33.25,49.22) 33.23,49.2 USB1.6 33.23,47.51 33.27,47.46 33.27,37.85 33.21,37.85 U7.33
  Bottom Layer w0.254: v3(32.23,49.68) 32.79,49.68 v3(33.25,49.22)
D-: length 14.2
  Top Layer w0.254: USB1.7 32.73,49.49 32.97,49.73 33.45,49.73 33.73,49.46 USB1.5 33.73,47.51 33.68,47.46 33.68,37.85 33.69,37.86 U7.32
OLED_DS: length 35.6
  Top Layer w0.254: U7.19 46.35,34.67 46.86,35.18 46.86,36.7 47.37,37.21 v2(59.82,37.21) ; v2(62.36,37.21) 65.4,37.21 66.04,37.85 OLED1.6
  Bottom Layer w0.254: v2(62.36,37.21) v2(59.82,37.21)
OLED_RES: length 33.6
  Top Layer w0.254: v2(59.82,35.69) 48.39,35.69 48.01,35.31 48.01,34.8 47.38,34.17 U7.18
  Bottom Layer w0.254: v2(59.82,35.69) 62.74,35.69 63.63,36.58 63.63,42.93 63.5,43.05
PB4: length 28.7
  Top Layer w0.254: v2(44.07,45.85) 44.07,46.9 C32.2 44.37,47.2 SW2.2 ; v2(29.21,36.45) 29.99,35.67 U7.40
  Bottom Layer w0.254: v2(29.21,36.45) 38.99,36.45 39.62,37.08 39.62,44.96 40.51,45.85 v2(44.07,45.85)
PB5: length 35.6
  Top Layer w0.254: U7.41 28.84,35.17 v2(28.32,35.69) ; v2(48.51,45.21) 48.51,46.93 C33.2 48.81,47.35 SW3.2
  Bottom Layer w0.254: v2(48.51,45.21) 42.04,45.21 40.89,44.07 40.89,36.19 40.39,35.69 v2(28.32,35.69)
PB6: length 41
  Top Layer w0.254: SW4.2 53.52,47.34 C34.2 53.21,47.03 v2(53.21,45.08) ; v2(28.19,34.67) 30.99,34.67 U7.42
  Bottom Layer w0.254: v2(28.19,34.67) 42.16,34.67 42.8,35.31 42.8,43.56 43.81,44.58 52.7,44.58 v2(53.21,45.08)
RST: length 49.6
  Top Layer w0.254: U7.7 34.69,26.4 35.18,25.91 v2(40.39,25.91) ; C31.2 58.04,46.9 v2(58.04,44.96) ; 57.91,47.12 58.23,47.43 SW1.2
  Bottom Layer w0.254: v2(40.39,25.91) 44.58,25.91 44.96,26.29 44.96,38.23 45.97,39.24 56.26,39.24 57.02,40 57.02,44.58 57.4,44.96 v2(58.04,44.96)
SPI_MOSI: length 31.6
  Top Layer w0.254: OLED1.4 60.96,35.05 60.33,34.42 57.91,34.42 57.16,33.67 U7.17
SPI_NSS: length 41.2
  Top Layer w0.254: v2(68.58,32.77) 67.98,32.17 U7.14
  Bottom Layer w0.254: v2(68.58,32.77) OLED1.7
SPI_SCK: length 30.6
  Top Layer w0.254: U7.15 57.69,32.67 v2(58.55,33.53)
  Bottom Layer w0.254: OLED1.3 58.55,42.93 v2(58.55,33.53)
SWD: length 22.2
  Top Layer w0.254: U7.34 32.69,39.19 v2(32.64,39.24)
  Bottom Layer w0.254: v2(32.64,39.24) 23.49,39.24 22.86,39.88 H1.2
UART_RX: length 20
  Top Layer w0.254: v4(34.16,38.99) 34.19,38.96 U7.31 ; U8.6 20.7,38.73 v2(21.34,38.1)
  Bottom Layer w0.254: v2(21.34,38.1) 21.46,37.97 33.15,37.97 v4(34.16,38.99)
UART_TX: length 23.5
  Top Layer w0.254: v2(35.69,39.75) 34.92,39.75 34.69,39.52 U7.30 ; v2(22.23,38.61) 20.83,40 16.02,40
  Bottom Layer w0.254: v2(35.69,39.75) 34.04,39.75 32.89,38.61 v2(22.23,38.61)
UD+: length 8.7
  Top Layer w0.254: v3(5.26,40.89) 6.31,40.89 USB2.6 9.2,40.88 9.59,41.28 U8.1 ; v3(4.65,39.88) 6.31,39.88 USB2.8
  Bottom Layer w0.254: v3(5.26,40.89) 4.85,40.89 4.65,40.69 v3(4.65,39.88)
UD-: length 8.5
  Top Layer w0.254: USB2.5 4.83,41.38 4.7,41.25 4.7,40.54 4.85,40.38 USB2.7 ; 6.42,40.46 6.44,40.44 9.16,40.44 9.59,40 10.65,40
$1N8156: length 3.1
  Top Layer w0.254: USB1.10 31.24,48.2 v2(31.24,50.04)
  Bottom Layer w0.254: v2(31.24,50.04) R1.1
$1N8157: length 3.2
  Top Layer w0.254: USB1.4 v2(34.23,50.04)
  Bottom Layer w0.254: v2(34.23,50.04) 34.16,50.04 R2.1
$1N8181: length 2.2
  Top Layer w0.4: LED2.1 22.11,46.27 R4.1
$1N8217: length 2
  Top Layer w0.4: LED3.1 19.68,32.4 R3.1
$1N8224: length 3.6
  Top Layer w0.254: R12.2 18.79,13.46 arc(18.79,13.46) R14.1 20.57,13.47 arc(20.58,13.47) R13.1
$1N8225: length 12.5
  Top Layer w0.254: R11.2 U3.2 17.14,7.24 arc(17.77,7.5) 18.03,8.13 18.03,11.5 ; 18.03,11.5 15.94,11.5 arc(15.62,11.62) 15.49,11.94 15.49,13.45 arc(15.5,13.46) R12.1 ; 18.03,11.5 arc(18.05,11.54) 18.1,11.56
$1N8226: length 14.2
  Top Layer w0.254: R15.1 arc(23.75,5.85) 23.76,5.97 U3.6 20.07,5.97 arc(19.66,6.14) 19.5,6.54 C14.2 21.59,11.56 arc(21.95,11.71) 22.1,12.06 22.1,13.45 arc(22.1,13.46) R13.2
$1N8235: length 2
  Top Layer w0.254: 10.35,7.24 R11.1
$1N8236: length 4.8
  Top Layer w0.254: RF1.5 8.93,7.21 C19.1
$1N8239: length 3.4
  Top Layer w0.254: U4.5 41.61,11.44 R19.1 43.18,11.42 R18.2
$1N8242: length 6.1
  Top Layer w0.254: 39.12,15.11 39.12,11.99 U4.6 ; 39.12,15.11 39.12,15.12 R21.1 arc(39.21,15.15) 39.12,15.11 ; 39.12,15.11 arc(39.11,15.1) 39.1,15.1 R20.1
$1N8243: length 3.8
  Top Layer w0.254: R21.2 39.24,18.66 arc(39.25,18.67) R22.2 R24.2
$1N8244: length 4.4
  Top Layer w0.254: R22.1 43.54,20.18 arc(43.58,20.24) R25.2
$1N8248: length 2.5
  Top Layer w0.254: R16.2 U4.3
$1N8249: length 20
  Top Layer w0.254: R15.2 27.56,5.84 arc(27.92,5.99) 28.07,6.35 R17.1 28.96,8.51 arc(29.41,8.32) 29.59,7.87 29.59,4.95 arc(29.81,4.41) 30.35,4.19 36.83,4.19 arc(37.19,4.34) 37.34,4.7 37.34,5.99 arc(37.33,6.02) U4.2
$1N8289: length 5.1
  Top Layer w0.254: C24.2 53.53,4.44 49.91,4.44 49.6,4.76 49.6,5.67
$1N8292: length 2.2
  Top Layer w0.254: C24.1 53.45,2.97 U6.6
$1N8306: length 5.2
  Top Layer w0.254: R28.1 47.62,2.03 48.13,1.52 50.04,1.52 50.55,2.03 U6.5
$1N8314: length 1.9
  Top Layer w0.254: 50.4,14.74 52.33,14.74
$1N12238: length 11.6
  Top Layer w0.254: 32.81,23.05 32.13,23.73 32.13,25.53 32.51,25.91 33.27,25.91 33.69,26.33 U7.5 ; 32.81,23.05 32.55,22.8 C27.1 ; 32.81,23.05 33.17,23.05 X1.3
$1N12242: length 9.1
  Top Layer w0.254: U7.6 34.19,25.92 X1.1 37.2,24.73 C26.2
$1N12291: length 7
  Top Layer w0.254: 35.69,30.97 35.69,29.08 35.94,28.83 C29.2 36.38,28.13 36.58,27.94 39.55,27.94 L2.2
$1N12611: length 5.1
  Top Layer w0.254: R31.1 35.56,26.67 35.19,27.04 U7.8
$1N12664: length 3.5
  Top Layer w0.254: U7.20 41.02,35.17 R32.1
$1N12771: length 3.8
  Top Layer w0.254: C30.1 39.75,37.08 38.83,36.17 U7.22
$1N12812: length 5.7
  Top Layer w0.254: R33.1 27.79,32 29.45,33.67 U7.44
$1N13466: length 9.6
  Top Layer w0.254: U7.2 32.19,27.62 30.61,26.04 LED8.2
$1N13568: length 9.2
  Top Layer w0.254: LED7.2 38.61,44.66 38.61,39.75 38.1,39.24 36.07,39.24 35.69,38.87 35.69,37.87
$1N13570: length 2.2
  Top Layer w0.254: LED7.1 42.8,44.7 arc(42.9,44.74) R35.2
$1N13643: length 2
  Top Layer w0.254: LED8.1 24.38,24.37 R34.2
$1N14205: length 2.9
  Top Layer w0.254: USB2.10 v2(4.7,38.88)
  Bottom Layer w0.254: v2(4.7,38.88) 3.54,38.88 R37.1
$1N14206: length 2.9
  Top Layer w0.254: v2(4.44,41.91) 6.29,41.91 USB2.4
  Bottom Layer w0.254: R38.1 3.59,41.91 v2(4.44,41.91)
$1N14285: length 1.6
  Top Layer w0.254: U8.8 16.02,42.85 C35.1
$1N17032: length 2.4
  Top Layer w0.254: R29.1 71.1,11.93 69.46,11.93

## Copper pours and planes (outline as drawn; the poured copper is in the pictures)
+12V on Top Layer: 61,25.53 67.48,25.53 67.48,10.91 61,10.91
+12V on Bottom Layer: 61,25.53 67.48,25.53 67.48,10.91 61,10.91
AGND on Top Layer: -1.52,19.56 45.97,19.56 45.97,-8.13 -1.52,-8.13
AGND on Bottom Layer: -1.52,19.43 45.97,19.43 45.97,-8.25 -1.52,-8.25
GND on Top Layer: -22.89,73.76 95.17,73.76 95.17,-11.99 -22.89,-11.99
GND on Bottom Layer: -8.2,60.05 109.86,60.05 109.86,-25.71 -8.2,-25.71
PGND on Top Layer: 46.23,30.99 84.58,30.99 84.58,-4.7 46.23,-4.7
PGND on Bottom Layer: 46.1,31.05 84.45,31.05 84.45,-4.64 46.1,-4.64
$1N17031 on Top Layer: 58.67,17.02 63.12,17.02 63.12,8.25 58.67,8.25
$1N17031 on Bottom Layer: 58.67,17.02 63.12,17.02 63.12,8.25 58.67,8.25

## Text on the board
Top Silkscreen Layer: GND | CLK | 3V3 | SWD | TP1 | VBUS | PC13 | TP2 | TP4 | PB15 | TP3 | +5V | -5V | PB4 | MOSI | PB5 | RES | PB6 | DC | RST | NSS | +12V | USB-UART | Designed By Shawn 2024.1.13 | CH340N | OPA657 | USB-AUDIO | STM32F401CCU6 | LF353
